# Altium project CNC_Control.PrjPcb
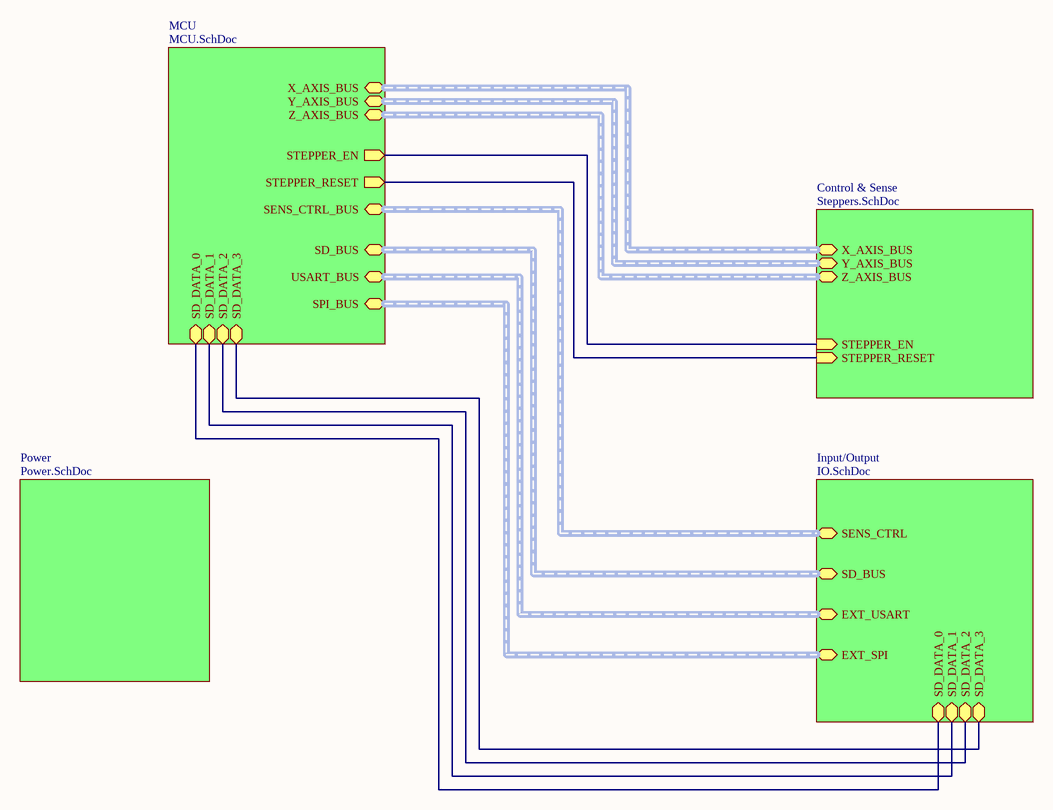
[diagram p0: Master.SchDoc]
5 sheets, 75 parts. Net scope: hierarchical (ports join the sheet entries above them; power ports are global).
Board file: CNC-Control.PcbDoc
Sheets:
  Master.SchDoc
    MCU = MCU.SchDoc
    Control & Sense = Steppers.SchDoc
    Power = Power.SchDoc
    Input/Output = IO.SchDoc

## Sheet Master.SchDoc
size A4

### Sub-sheets
Control & Sense = Steppers.SchDoc: X_AXIS_BUS (harness STEPPER), Y_AXIS_BUS (harness STEPPER), Z_AXIS_BUS (harness STEPPER), STEPPER_EN (in), STEPPER_RESET (in)
Input/Output = IO.SchDoc: SENS_CTRL (harness SENS_CTRL), SD_BUS (harness SD_CARD), EXT_USART (harness USART), EXT_SPI (harness SPI), SD_DATA_0 (bidir), SD_DATA_1 (bidir), SD_DATA_2 (bidir), SD_DATA_3 (bidir)
MCU = MCU.SchDoc: X_AXIS_BUS (harness STEPPER), Y_AXIS_BUS (harness STEPPER), Z_AXIS_BUS (harness STEPPER), STEPPER_EN (out), STEPPER_RESET (out), SENS_CTRL_BUS (harness SENS_CTRL), USART_BUS (harness USART), SD_BUS (harness SD_CARD), SPI_BUS (harness SPI), SD_DATA_0 (bidir), SD_DATA_1 (bidir), SD_DATA_2 (bidir), SD_DATA_3 (bidir)
Power = Power.SchDoc: no entries

### Nets
STEPPER_EN: sheet MCU/STEPPER_EN, sheet Control & Sense/STEPPER_EN
STEPPER_RESET: sheet MCU/STEPPER_RESET, sheet Control & Sense/STEPPER_RESET
NetJ301_1: sheet MCU/SD_DATA_2, sheet Input/Output/SD_DATA_2
NetJ301_2: sheet MCU/SD_DATA_3, sheet Input/Output/SD_DATA_3
NetJ301_7: sheet MCU/SD_DATA_0, sheet Input/Output/SD_DATA_0
NetJ301_8: sheet MCU/SD_DATA_1, sheet Input/Output/SD_DATA_1

### Buses and harness runs
harness sheet Control & Sense/X_AXIS_BUS = sheet MCU/X_AXIS_BUS
harness sheet Control & Sense/Y_AXIS_BUS = sheet MCU/Y_AXIS_BUS
harness sheet Control & Sense/Z_AXIS_BUS = sheet MCU/Z_AXIS_BUS
harness sheet Input/Output/EXT_SPI = sheet MCU/SPI_BUS
harness sheet Input/Output/EXT_USART = sheet MCU/USART_BUS
harness sheet Input/Output/SD_BUS = sheet MCU/SD_BUS
harness sheet Input/Output/SENS_CTRL = sheet MCU/SENS_CTRL_BUS

## Sheet MCU.SchDoc
size A4
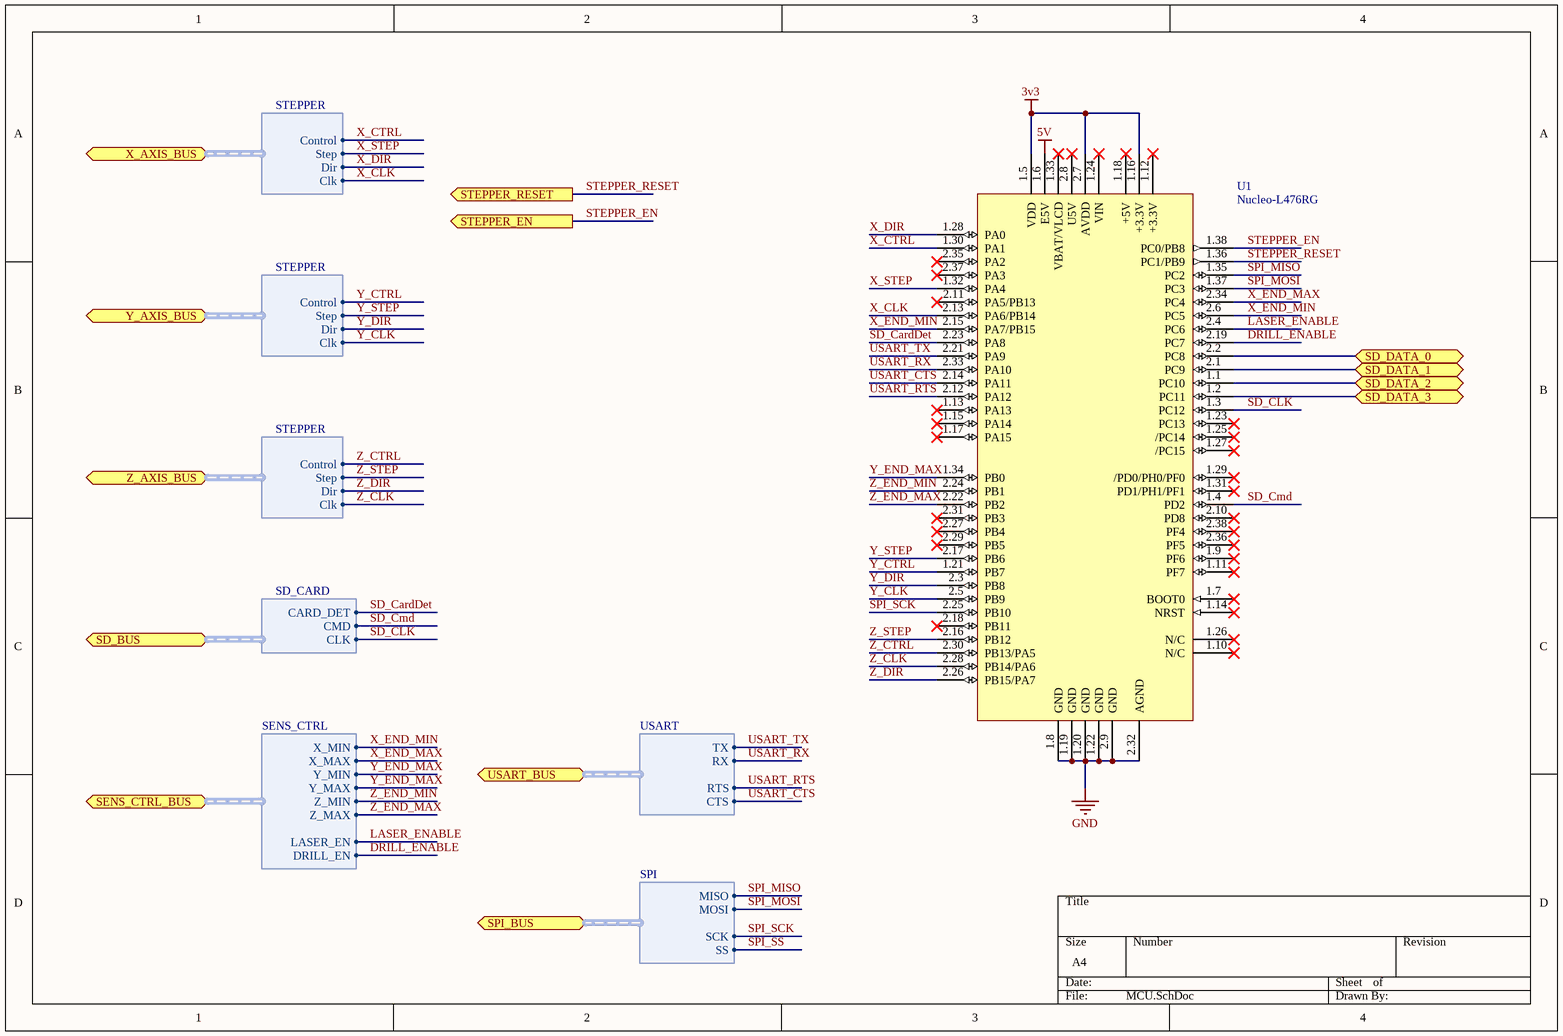
[diagram p1: MCU.SchDoc]

### Parts
U1  Nucleo-L476RG  [NUCLEO--F103RB]

### Ports
SD_BUS (harness SD_CARD), SD_DATA_0 (bidir), SD_DATA_1 (bidir), SD_DATA_2 (bidir), SD_DATA_3 (bidir), SENS_CTRL_BUS (harness SENS_CTRL), SPI_BUS (harness SPI), STEPPER_EN (out), STEPPER_RESET (out), USART_BUS (harness USART), X_AXIS_BUS (harness STEPPER), Y_AXIS_BUS (harness STEPPER), Z_AXIS_BUS (harness STEPPER)

### Harnesses
STEPPER: Clk, Dir, Step, Control
SD_CARD: CARD_DET, CMD, CLK
SENS_CTRL: X_MIN, X_MAX, Y_MIN, Y_MAX, Z_MIN, Z_MAX, LASER_EN, DRILL_EN
USART: TX, RX, RTS, CTS
SPI: MISO, MOSI, SCK, SS

### Nets
3v3: U1.1.5(VDD) U1.1.16(+3.3V) U1.2.7(AVDD)
5V: U1.1.6(E5V)
GND: U1.1.8(GND) U1.1.19(GND) U1.1.20(GND) U1.1.22(GND) U1.2.9(GND) U1.2.32(AGND)
DRILL_ENABLE: U1.2.19(PC7) ; port SENS_CTRL_BUS.DRILL_EN
LASER_ENABLE: U1.2.4(PC6) ; port SENS_CTRL_BUS.LASER_EN
SD_CardDet: U1.2.23(PA8) ; port SD_BUS.CARD_DET
SD_CLK: U1.1.3(PC12) ; port SD_BUS.CLK
SD_Cmd: U1.1.4(PD2) ; port SD_BUS.CMD
SPI_MISO: U1.1.35(PC2) ; port SPI_BUS.MISO
SPI_MOSI: U1.1.37(PC3) ; port SPI_BUS.MOSI
SPI_SCK: U1.2.25(PB10) ; port SPI_BUS.SCK
STEPPER_EN: U1.1.38(PC0/PB8) ; port STEPPER_EN
STEPPER_RESET: U1.1.36(PC1/PB9) ; port STEPPER_RESET
USART_CTS: U1.2.14(PA11) ; port USART_BUS.CTS
USART_RTS: U1.2.12(PA12) ; port USART_BUS.RTS
USART_RX: U1.2.33(PA10) ; port USART_BUS.RX
USART_TX: U1.2.21(PA9) ; port USART_BUS.TX
X_CLK: U1.2.13(PA6/PB14) ; port X_AXIS_BUS.Clk
X_CTRL: U1.1.30(PA1) ; port X_AXIS_BUS.Control  [project net X_AXIS_CTRL]
X_DIR: U1.1.28(PA0) ; port X_AXIS_BUS.Dir  [project net X_AXIS_DIR]
X_END_MAX: U1.2.34(PC4) ; port SENS_CTRL_BUS.X_MAX
X_END_MIN: U1.2.6(PC5) U1.2.15(PA7/PB15) ; port SENS_CTRL_BUS.X_MIN
X_STEP: U1.1.32(PA4) ; port X_AXIS_BUS.Step  [project net X_AXIS_STEP]
Y_CLK: U1.2.5(PB9) ; port Y_AXIS_BUS.Clk
Y_CTRL: U1.1.21(PB7) ; port Y_AXIS_BUS.Control
Y_DIR: U1.2.3(PB8) ; port Y_AXIS_BUS.Dir
Y_END_MAX: U1.1.34(PB0) ; port SENS_CTRL_BUS.Y_MIN, port SENS_CTRL_BUS.Y_MAX
Y_STEP: U1.2.17(PB6) ; port Y_AXIS_BUS.Step
Z_CLK: U1.2.28(PB14/PA6) ; port Z_AXIS_BUS.Clk
Z_CTRL: U1.2.30(PB13/PA5) ; port Z_AXIS_BUS.Control
Z_DIR: U1.2.26(PB15/PA7) ; port Z_AXIS_BUS.Dir
Z_END_MAX: U1.2.22(PB2) ; port SENS_CTRL_BUS.Z_MAX
Z_END_MIN: U1.2.24(PB1) ; port SENS_CTRL_BUS.Z_MIN
Z_STEP: U1.2.16(PB12) ; port Z_AXIS_BUS.Step
NetJ301_1: U1.1.1(PC10) ; port SD_DATA_2
NetJ301_2: U1.1.2(PC11) ; port SD_DATA_3
NetJ301_7: U1.2.2(PC8) ; port SD_DATA_0
NetJ301_8: U1.2.1(PC9) ; port SD_DATA_1

Not connected (* = marked no-connect by the designer): U1 1.7(BOOT0)* 1.9(PF6)* 1.10(N/C)* 1.11(PF7)* 1.12(+3.3V)* 1.13(PA13)* 1.14(NRST)* 1.15(PA14)* 1.17(PA15)* 1.18(+5V)* 1.23(PC13)* 1.24(VIN)* 1.25(/PC14)* 1.26(N/C)* 1.27(/PC15)* 1.29(/PD0/PH0/PF0)* 1.31(PD1/PH1/PF1)* 1.33(VBAT/VLCD)* 2.8(U5V)* 2.10(PD8)* 2.11(PA5/PB13)* 2.18(PB11)* 2.27(PB4)* 2.29(PB5)* 2.31(PB3)* 2.35(PA2)* 2.36(PF5)* 2.37(PA3)* 2.38(PF4)*

### Library data of the parts
U1 = Nucleo-F103RB

## Sheet Steppers.SchDoc
size A4
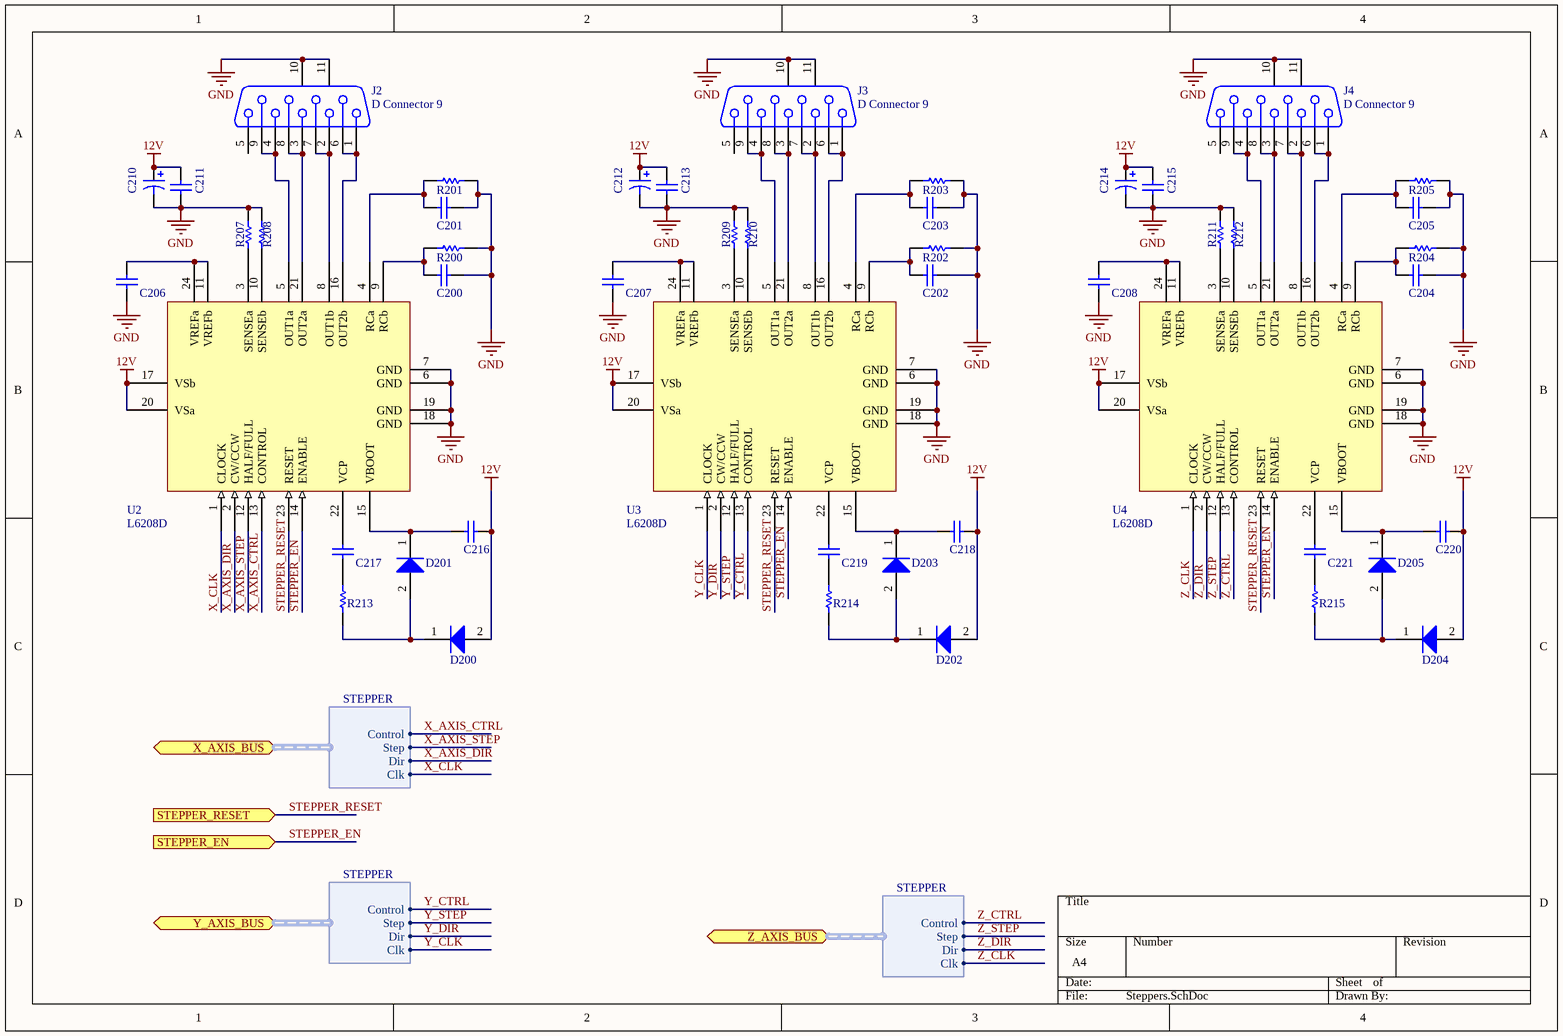
[diagram p2: Steppers.SchDoc]

### Parts
C200  CAP 100nF 10V 1206(3216)  [CAPC1206(3216)190_N]  (value not drawn)
C201  CAP 100nF 10V 1206(3216)  [CAPC1206(3216)190_N]  (value not drawn)
C202  CAP 100nF 10V 1206(3216)  [CAPC1206(3216)190_N]  (value not drawn)
C203  CAP 100nF 10V 1206(3216)  [CAPC1206(3216)190_N]  (value not drawn)
C204  CAP 100nF 10V 1206(3216)  [CAPC1206(3216)190_N]  (value not drawn)
C205  CAP 100nF 10V 1206(3216)  [CAPC1206(3216)190_N]  (value not drawn)
C206  CAP 100nF 10V 1206(3216)  [CAPC1206(3216)190_N]  (value not drawn)
C207  CAP 100nF 10V 1206(3216)  [CAPC1206(3216)190_N]  (value not drawn)
C208  CAP 100nF 10V 1206(3216)  [CAPC1206(3216)190_N]  (value not drawn)
C210  T491B  [B]  (value not drawn)
C211  CAP 100nF 10V 1206(3216)  [CAPC1206(3216)190_N]  (value not drawn)
C212  T491B  [B]  (value not drawn)
C213  CAP 100nF 10V 1206(3216)  [CAPC1206(3216)190_N]  (value not drawn)
C214  T491B  [B]  (value not drawn)
C215  CAP 100nF 10V 1206(3216)  [CAPC1206(3216)190_N]  (value not drawn)
C216  CAP 100nF 10V 1206(3216)  [CAPC1206(3216)190_N]  (value not drawn)
C217  CAP 100nF 10V 1206(3216)  [CAPC1206(3216)190_N]  (value not drawn)
C218  CAP 100nF 10V 1206(3216)  [CAPC1206(3216)190_N]  (value not drawn)
C219  CAP 100nF 10V 1206(3216)  [CAPC1206(3216)190_N]  (value not drawn)
C220  CAP 100nF 10V 1206(3216)  [CAPC1206(3216)190_N]  (value not drawn)
C221  CAP 100nF 10V 1206(3216)  [CAPC1206(3216)190_N]  (value not drawn)
D200  NSR0340HT1G  [ONSC-SOD-323-2-477-02_V]  (value not drawn)
D201  NSR0340HT1G  [ONSC-SOD-323-2-477-02_V]  (value not drawn)
D202  NSR0340HT1G  [ONSC-SOD-323-2-477-02_V]  (value not drawn)
D203  NSR0340HT1G  [ONSC-SOD-323-2-477-02_V]  (value not drawn)
D204  NSR0340HT1G  [ONSC-SOD-323-2-477-02_V]  (value not drawn)
D205  NSR0340HT1G  [ONSC-SOD-323-2-477-02_V]  (value not drawn)
J2  D Connector 9  [DSUB1.385-2H9]
J3  D Connector 9  [DSUB1.385-2H9]
J4  D Connector 9  [DSUB1.385-2H9]
R200  1K 5% 1206(3216)  [RESC1206(3216)_N]  (value not drawn)
R201  1K 5% 1206(3216)  [RESC1206(3216)_N]  (value not drawn)
R202  1K 5% 1206(3216)  [RESC1206(3216)_N]  (value not drawn)
R203  1K 5% 1206(3216)  [RESC1206(3216)_N]  (value not drawn)
R204  1K 5% 1206(3216)  [RESC1206(3216)_N]  (value not drawn)
R205  1K 5% 1206(3216)  [RESC1206(3216)_N]  (value not drawn)
R207  1R 5% 1210(3225)  [RESC1210(3225)_N]  (value not drawn)
R208  1R 5% 1210(3225)  [RESC1210(3225)_N]  (value not drawn)
R209  1R 5% 1210(3225)  [RESC1210(3225)_N]  (value not drawn)
R210  1R 5% 1210(3225)  [RESC1210(3225)_N]  (value not drawn)
R211  1R 5% 1210(3225)  [RESC1210(3225)_N]  (value not drawn)
R212  1R 5% 1210(3225)  [RESC1210(3225)_N]  (value not drawn)
R213  1K 5% 1206(3216)  [RESC1206(3216)_N]  (value not drawn)
R214  1K 5% 1206(3216)  [RESC1206(3216)_N]  (value not drawn)
R215  1K 5% 1206(3216)  [RESC1206(3216)_N]  (value not drawn)
U2  L6208D  [SO24_L]
U3  L6208D  [SO24_L]
U4  L6208D  [SO24_L]

### Ports
STEPPER_EN (in), STEPPER_RESET (in), X_AXIS_BUS (harness STEPPER), Y_AXIS_BUS (harness STEPPER), Z_AXIS_BUS (harness STEPPER)

### Harnesses
STEPPER: Clk, Dir, Step, Control

### Nets
12V: C210.1 C211.2 C212.1 C213.2 C214.1 C215.2 C216.1 C218.1 C220.1 D200.2(A) D202.2(A) D204.2(A) U2.17(VSb) U2.20(VSa) U3.17(VSb) U3.20(VSa) U4.17(VSb) U4.20(VSa)
GND: C200.2 C201.2 C202.2 C203.2 C204.2 C205.2 C206.1 C207.1 C208.1 C210.2 C211.1 C212.2 C213.1 C214.2 C215.1 J2.10(MH1) J2.11(MH2) J3.10(MH1) J3.11(MH2) J4.10(MH1) J4.11(MH2) R200.2 R201.2 R202.2 R203.2 R204.2 R205.2 R207.2 R208.2 R209.2 R210.2 R211.2 R212.2 U2.6(GND) U2.7(GND) U2.18(GND) U2.19(GND) U3.6(GND) U3.7(GND) U3.18(GND) U3.19(GND) U4.6(GND) U4.7(GND) U4.18(GND) U4.19(GND)
STEPPER_EN: U2.14(ENABLE) U3.14(ENABLE) U4.14(ENABLE) ; port STEPPER_EN
STEPPER_RESET: U2.23(RESET) U3.23(RESET) U4.23(RESET) ; port STEPPER_RESET
X_AXIS_CTRL: U2.13(CONTROL) ; port X_AXIS_BUS.Control
X_AXIS_DIR: U2.2(CW/CCW) ; port X_AXIS_BUS.Dir
X_AXIS_STEP: U2.12(HALF/FULL) ; port X_AXIS_BUS.Step
X_CLK: U2.1(CLOCK) ; port X_AXIS_BUS.Clk
Y_CLK: U3.1(CLOCK) ; port Y_AXIS_BUS.Clk
Y_CTRL: U3.13(CONTROL) ; port Y_AXIS_BUS.Control
Y_DIR: U3.2(CW/CCW) ; port Y_AXIS_BUS.Dir
Y_STEP: U3.12(HALF/FULL) ; port Y_AXIS_BUS.Step
Z_CLK: U4.1(CLOCK) ; port Z_AXIS_BUS.Clk
Z_CTRL: U4.13(CONTROL) ; port Z_AXIS_BUS.Control
Z_DIR: U4.2(CW/CCW) ; port Z_AXIS_BUS.Dir
Z_STEP: U4.12(HALF/FULL) ; port Z_AXIS_BUS.Step
NetC200_1: C200.1 R200.1 U2.9(RCb)
NetC201_1: C201.1 R201.1 U2.4(RCa)
NetC202_1: C202.1 R202.1 U3.9(RCb)
NetC203_1: C203.1 R203.1 U3.4(RCa)
NetC204_1: C204.1 R204.1 U4.9(RCb)
NetC205_1: C205.1 R205.1 U4.4(RCa)
NetC206_2: C206.2 U2.11(VREFb) U2.24(VREFa)
NetC207_2: C207.2 U3.11(VREFb) U3.24(VREFa)
NetC208_2: C208.2 U4.11(VREFb) U4.24(VREFa)
NetC216_2: C216.2 D201.1(K) U2.15(VBOOT)
NetC217_1: C217.1 R213.2
NetC217_2: C217.2 U2.22(VCP)
NetC218_2: C218.2 D203.1(K) U3.15(VBOOT)
NetC219_1: C219.1 R214.2
NetC219_2: C219.2 U3.22(VCP)
NetC220_2: C220.2 D205.1(K) U4.15(VBOOT)
NetC221_1: C221.1 R215.2
NetC221_2: C221.2 U4.22(VCP)
NetD200_1: D200.1(K) D201.2(A) R213.1
NetD202_1: D202.1(K) D203.2(A) R214.1
NetD204_1: D204.1(K) D205.2(A) R215.1
NetJ2_1: J2.1 J2.6 U2.16(OUT2b)
NetJ2_2: J2.2 J2.7 U2.8(OUT1b)
NetJ2_3: J2.3 J2.8 U2.21(OUT2a)
NetJ2_4: J2.4 J2.9 U2.5(OUT1a)
NetJ3_1: J3.1 J3.6 U3.16(OUT2b)
NetJ3_2: J3.2 J3.7 U3.8(OUT1b)
NetJ3_3: J3.3 J3.8 U3.21(OUT2a)
NetJ3_4: J3.4 J3.9 U3.5(OUT1a)
NetJ4_1: J4.1 J4.6 U4.16(OUT2b)
NetJ4_2: J4.2 J4.7 U4.8(OUT1b)
NetJ4_3: J4.3 J4.8 U4.21(OUT2a)
NetJ4_4: J4.4 J4.9 U4.5(OUT1a)
NetR207_1: R207.1 U2.3(SENSEa)
NetR208_1: R208.1 U2.10(SENSEb)
NetR209_1: R209.1 U3.3(SENSEa)
NetR210_1: R210.1 U3.10(SENSEb)
NetR211_1: R211.1 U4.3(SENSEa)
NetR212_1: R212.1 U4.10(SENSEb)

Not connected (* = marked no-connect by the designer): J2 5; J3 5; J4 5

### Library data of the parts
C200-C208 C211 C213 C215-C221 = CMP-1037-04171-1: CAP 100nF 10V ±5% 1206 (3216 Metric) Thickness 1.9mm SMD; Tolerance: Â±5%; Case-Metric: 3216; Case-EIA: 1206; Value: 100nF; Rated Voltage: 10 V; Technology: SMT; Max Thickness: 1.9 mm
C210 C212 C214 = T491B: Solid Tantalum Chip Capacitor, Standard T491 Series - Industrial Grade; Value: 100pF; Published: 17-Jul-2002; LatestRevisionDate: 19-Mar-2004; LatestRevisionNote: Silkscreen dimensions re-sized.; DatasheetDocument: Mar-2001; PackageDocument: Mar-2001; PackageReference: B; Publisher: Altium Limited; Code_JEITA: 3528-21; ComponentLink1Description: Manufacturer Link; ComponentLink1URL: http://www.kemet.com/; ComponentLink2Description: Datasheet; ComponentLink2URL: http://www.kemet.com/kemet/web/homepage/kechome.nsf/vapubfilesname/F3102TA.pdf/$file/F3102TA.pdf
D200-D205 = CMP-1055-00472-1: Schottky Barrier Diode, 2-Pin SOD-323, Pb-Free, Tape and Reel; Manufacturer: On Semiconductor; IFSM Max (A): 1; Configuration: Single; PackageDescription: 2-Pin SOD, Body 1.7 x 1.25 mm; ComponentLink2Description: Datasheet; PartNumber: NSR0340HT1G; ComponentLink3URL: http://www.onsemi.com/pub_link/Collateral/477-02.PDF.1; Packing: Tape and Reel; PackageVersion: Rev. H, 03/2007; ComponentLink1URL: http://www.onsemi.com/; ComponentLink2URL: http://www.onsemi.cn/pub_link/Collateral/NSR0340H-D.PDF; ComponentLink3Description: Package Specification; ComponentLink1Description: Manufacturer URL; Mounting Technology: Surface Mount; RoHS: TRUE; PackageReference: SOD-323-2-477-02; DatasheetVersion: Rev. 1
J2-J4 = D Connector 9: Receptacle Assembly, 9 Position, Right Angle; PackageDocument: O; Positions: 9; Published: 15-Jun-2001; LatestRevisionDate: 17-Jul-2002; LatestRevisionNote: Re-released for DXP Platform.; DatasheetDocument: 1-Sep-1999; PackageReference: 788750; Publisher: Altium Limited; Orientation: Right Angle; Gender: Receptacle
R200-R205 R213-R215 = CMP-1014-00074-1: 1K 0.25W 5% 1206 (3216 Metric)  SMD; Value: 1000.00 Ohm; Case-Metric: 3216; Case-EIA: 1206; Tolerance: 5 %; Power: 0.25 W; Technology: SMT
R207-R212 = CMP-1015-00002-1: 1R 0.5W 5% 1210 (3225 Metric)  SMD; Case-EIA: 1210; Value: 1.00 Ohm; Case-Metric: 3225; Power: 0.5 W; Technology: SMT; Tolerance: 5 %
U2-U4 = L6208D: Stepper controler

## Sheet Power.SchDoc
size A4
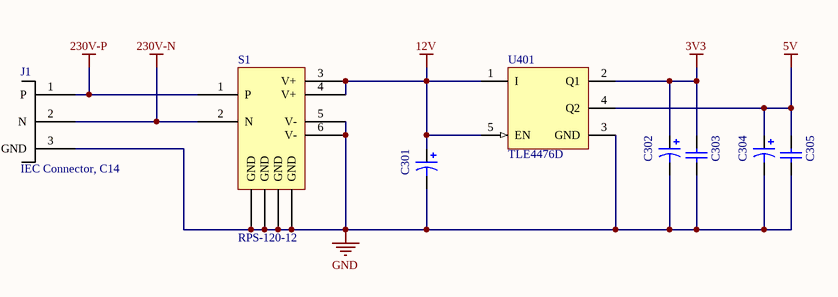
[diagram p3: Power.SchDoc]

### Parts
C301  T491B  [B]  (value not drawn)
C302  T491B  [B]  (value not drawn)
C303  CAP 100nF 10V 1206(3216)  [CAPC1206(3216)190_N]  (value not drawn)
C304  T491B  [B]  (value not drawn)
C305  CAP 100nF 10V 1206(3216)  [CAPC1206(3216)190_N]  (value not drawn)
J1  IEC Connector, C14  [PX0580]
S1  RPS-120-12  [RPS-120-12]
U401  TLE4476D  [INF-PG-TO252-5-11_M]

### Nets
3v3: C302.1 C303.2 U401.2(Q1)
5V: C304.1 C305.2 U401.4(Q2)
12V: C301.1 S1.3(V+) S1.4(V+) U401.1(I) U401.5(EN)
230V-N: J1.2(N) S1.2(N)
230V-P: J1.1(P) S1.1(P)
GND: C301.2 C302.2 C303.1 C304.2 C305.1 J1.3(GND) S1.5(V-) S1.6(V-) S1.H1(GND) S1.H2(GND) S1.H3(GND) S1.H4(GND) U401.3(GND)

### Library data of the parts
C301 C302 C304 = T491B: as C210 on sheet Steppers; Published: 17-Jul-2002; LatestRevisionDate: 19-Mar-2004; LatestRevisionNote: Silkscreen dimensions re-sized.; DatasheetDocument: Mar-2001; PackageDocument: Mar-2001; PackageReference: B; Publisher: Altium Limited; Code_JEITA: 3528-21; ComponentLink1Description: Manufacturer Link; ComponentLink1URL: http://www.kemet.com/; ComponentLink2Description: Datasheet; ComponentLink2URL: http://www.kemet.com/kemet/web/homepage/kechome.nsf/vapubfilesname/F3102TA.pdf/$file/F3102TA.pdf
C303 C305 = CMP-1037-04171-1: as C200 on sheet Steppers; Value: 100nF; Rated Voltage: 10 V; Technology: SMT; Max Thickness: 1.9 mm
J1 = PX0580/PC/12132: IEC C14, Right Angle Male, Mounting Holes; Ref: PX0580/PC/12132
S1 = RPS-120-12: Power supply, 120 W, 12V/10A, unenclosed; Ref: RPS-120-12
U401 = CMP-1109-00149-1: Dual Low Drop Voltage Regulator, 4.5 to 42 V / 5.7 to 42 V Supply, 3.3 V 5 V Output, -40 to 150 degC, PG-TO252-5-11, Reel, Green; Manufacturer: Infineon; Typical Quiescent Current: 300 uA; Regulator Type: multiple output; Max. Output Current: 350 mA 430 mA; Operating Range: 4.5 to 42 V 5.7 to 42 V; Dropout Voltage: 1200 mV 300 mV; Accuracy: 4 % 4 %; Green: TRUE; Output Voltage: 3.3V 5V; ComponentLink1Description: Manufacturer URL; ComponentLink3URL: http://www.infineon.com/dgdl/TLE7276-Data+Sheet-+v1_11.pdf?folderId=db3a304412b407950112b408e8c90004&fileId=db3a304412b407950112b436c53f66c8&sId=db3a30433db6f09f013dc0e43c0428c1; ComponentLink2URL: http://www.infineon.com/dgdl/TLE4476_DS_25%5B1%5D.pdf?folderId=db3a304318f3fe290118f5a433570040&fileId=db3a30431c48a312011c55e0456c0243&location=en.Products.Automotive_ICs.Linear_Voltage_Regulators_for_Automotive-Applications.Linear_Voltage_Regulators_-_Se; ComponentLink1URL: http://www.infineon.com/; PackageReference: PG-TO252-5-11; PackageDescription: 5-Pin Plastic (Green) Transistor Single Outline Package, 6.5 x 6.12 mm Body, 1.14 mm Pitch; ComponentLink2Description: Datasheet; PackageVersion: Nov-10; PartNumber: TLE4476D; Packing: Reel; Mounting Technology: Surface Mount; DatasheetVersion: Rev. 2.5; Halogen-free: TRUE; ComponentLink3Description: Package Specification

## Sheet IO.SchDoc
size A4
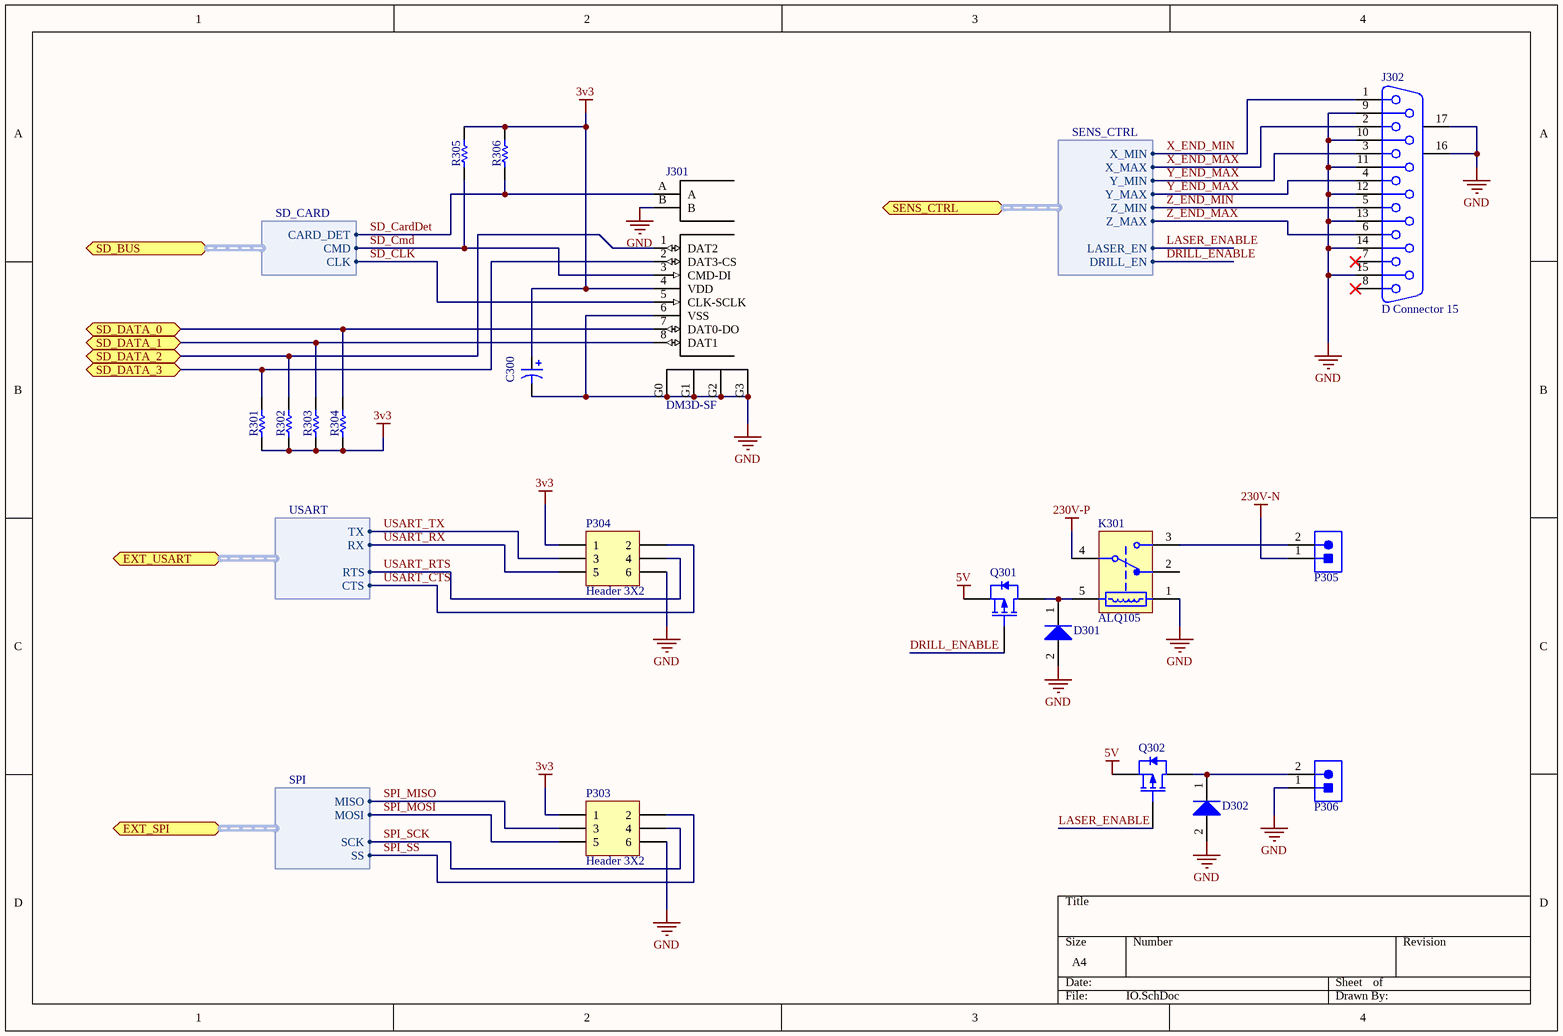
[diagram p4: IO.SchDoc]

### Parts
C300  T491B  [B]  (value not drawn)
D301  NSR0340HT1G  [ONSC-SOD-323-2-477-02_V]  (value not drawn)
D302  NSR0340HT1G  [ONSC-SOD-323-2-477-02_V]  (value not drawn)
J301  DM3D-SF  [DM3D-SF]
J302  D Connector 15  [DSUB1.385-2H15]
K301  ALQ105  [PNSC-LQ-5-2000x1000x1600_V]
P303  Header 3X2  [HDR2X3]
P304  Header 3X2  [HDR2X3]
P305  SCREW-5.0/5.08 2WAYS  [SCREW-5.0-2WAYS_V]  (value not drawn)
P306  SCREW-5.0/5.08 2WAYS  [SCREW-5.0-2WAYS_V]  (value not drawn)
Q301  BSS84  [SOT23_N]  (value not drawn)
Q302  BSS84  [SOT23_N]  (value not drawn)
R301  1K 5% 1206(3216)  [RESC1206(3216)_N]  (value not drawn)
R302  1K 5% 1206(3216)  [RESC1206(3216)_N]  (value not drawn)
R303  1K 5% 1206(3216)  [RESC1206(3216)_N]  (value not drawn)
R304  1K 5% 1206(3216)  [RESC1206(3216)_N]  (value not drawn)
R305  1K 5% 1206(3216)  [RESC1206(3216)_N]  (value not drawn)
R306  1K 5% 1206(3216)  [RESC1206(3216)_N]  (value not drawn)

### Ports
EXT_SPI (harness SPI), EXT_USART (harness USART), SD_BUS (harness SD_CARD), SD_DATA_0 (bidir), SD_DATA_1 (bidir), SD_DATA_2 (bidir), SD_DATA_3 (bidir), SENS_CTRL (harness SENS_CTRL)

### Harnesses
SENS_CTRL: X_MIN, X_MAX, Y_MIN, Y_MAX, Z_MIN, Z_MAX, LASER_EN, DRILL_EN
USART: TX, RX, RTS, CTS
SPI: MISO, MOSI, SCK, SS
SD_CARD: CARD_DET, CMD, CLK

### Nets
3v3: C300.1 J301.4(VDD) P303.1 P304.1 R301.1 R302.1 R303.1 R304.1 R305.2 R306.2
5V: Q301.2(S) Q302.2(S)
230V-N: P305.1
230V-P: K301.4(COM)
GND: C300.2 D301.2(A) D302.2(A) J301.6(VSS) J301.B J301.G0 J301.G1 J301.G2 J301.G3 J302.9 J302.10 J302.11 J302.12 J302.13 J302.14 J302.15 J302.16(MH1) J302.17(MH2) K301.1 P303.6 P304.6 P306.1
DRILL_ENABLE: Q301.1(G) ; port SENS_CTRL.DRILL_EN
LASER_ENABLE: Q302.1(G) ; port SENS_CTRL.LASER_EN
SD_CardDet: J301.A R306.1 ; port SD_BUS.CARD_DET
SD_CLK: J301.5(CLK-SCLK) ; port SD_BUS.CLK
SD_Cmd: J301.3(CMD-DI) R305.1 ; port SD_BUS.CMD
SPI_MISO: P303.3 ; port EXT_SPI.MISO
SPI_MOSI: P303.5 ; port EXT_SPI.MOSI
SPI_SCK: P303.4 ; port EXT_SPI.SCK
SPI_SS: P303.2 ; port EXT_SPI.SS
USART_CTS: P304.2 ; port EXT_USART.CTS
USART_RTS: P304.4 ; port EXT_USART.RTS
USART_RX: P304.5 ; port EXT_USART.RX
USART_TX: P304.3 ; port EXT_USART.TX
X_END_MAX: J302.2 ; port SENS_CTRL.X_MAX
X_END_MIN: J302.1 ; port SENS_CTRL.X_MIN
Y_END_MAX: J302.3 J302.4 ; port SENS_CTRL.Y_MIN, port SENS_CTRL.Y_MAX
Z_END_MAX: J302.6 ; port SENS_CTRL.Z_MAX
Z_END_MIN: J302.5 ; port SENS_CTRL.Z_MIN
NetD301_1: D301.1(K) K301.5 Q301.3(D)
NetD302_1: D302.1(K) P306.2 Q302.3(D)
NetJ301_1: J301.1(DAT2) R302.2 ; port SD_DATA_2
NetJ301_2: J301.2(DAT3-CS) R301.2 ; port SD_DATA_3
NetJ301_7: J301.7(DAT0-DO) R304.2 ; port SD_DATA_0
NetJ301_8: J301.8(DAT1) R303.2 ; port SD_DATA_1
NetK301_3: K301.3(NO) P305.2

Not connected (* = marked no-connect by the designer): J302 7* 8*; K301 2(NC)

### Library data of the parts
C300 = T491B: as C210 on sheet Steppers; Published: 17-Jul-2002; LatestRevisionDate: 19-Mar-2004; LatestRevisionNote: Silkscreen dimensions re-sized.; DatasheetDocument: Mar-2001; PackageDocument: Mar-2001; PackageReference: B; Publisher: Altium Limited; Code_JEITA: 3528-21; ComponentLink1Description: Manufacturer Link; ComponentLink1URL: http://www.kemet.com/; ComponentLink2Description: Datasheet; ComponentLink2URL: http://www.kemet.com/kemet/web/homepage/kechome.nsf/vapubfilesname/F3102TA.pdf/$file/F3102TA.pdf
D301 D302 = CMP-1055-00472-1: as D200 on sheet Steppers; PackageDescription: 2-Pin SOD, Body 1.7 x 1.25 mm; ComponentLink2Description: Datasheet; PartNumber: NSR0340HT1G; ComponentLink3URL: http://www.onsemi.com/pub_link/Collateral/477-02.PDF.1; Packing: Tape and Reel; PackageVersion: Rev. H, 03/2007; ComponentLink1URL: http://www.onsemi.com/; ComponentLink2URL: http://www.onsemi.cn/pub_link/Collateral/NSR0340H-D.PDF; ComponentLink3Description: Package Specification; ComponentLink1Description: Manufacturer URL; Mounting Technology: Surface Mount; RoHS: TRUE; PackageReference: SOD-323-2-477-02; DatasheetVersion: Rev. 1
J302 = D Connector 15: Receptacle Assembly, 15 Position, Right Angle; PackageDocument: O; Positions: 15; Published: 15-Jun-2001; LatestRevisionDate: 17-Jul-2002; LatestRevisionNote: Re-released for DXP Platform.; DatasheetDocument: 1-Sep-99; PackageReference: 788757; Publisher: Altium Limited; Orientation: Right Angle; Gender: Receptacle
K301 = CMP-1503-00191-1: LQ Relays, 5 V Coil Voltage, 400 mW Nominal Operating Power, -40 to 85 degC, 5-Pin LQ, Carton, Case, RoHS; Manufacturer: Panasonic; Coil Voltage: 5 V; Max Switching Voltage: 250 V AC; Mechanical Life(Min.operation): 1x10^7; Electrical Life: 5x10^4; Pb-Free: True; Nominal Operating Power: 400 mW; Max Switching Current: 10 A (N.O.), 3 A (N.C.); RoHS: True; PackageReference: LQ-5-2000x1000x1600; Packing: Carton, Case; PackageDescription: 5-Pin Through Hole Terminal Package, Body 20 x 10 mm; ComponentLink1Description: Manufacturer URL; ComponentLink3Description: Package Specification; DatasheetVersion: 201410-T; ComponentLink1URL: http://www3.panasonic.biz/ac/ae/index.jsp; ComponentLink3URL: http://www3.panasonic.biz/ac/e_download/control/relay/power/catalog/mech_eng_lq.pdf?f_cd=401220; PartNumber: ALQ105; Mounting Technology: Through Hole; ComponentLink2Description: Datasheet; Series: LQ Relays; ComponentLink2URL: http://www3.panasonic.biz/ac/e_download/control/relay/power/catalog/mech_eng_lq.pdf?f_cd=401220; PackageVersion: ASCTB92E, 10/2014
P303 P304 = Header 3X2: Header, 3-Pin, Dual row; LatestRevisionDate: 17-Jul-2002; LatestRevisionNote: Re-released for DXP Platform.; Publisher: Altium Limited
P305 P306 = CMP-0617-00009-1: Socket, Screw Terminal Block, 2 Way, 5.0 mm Pitch, 90 Degree Angle, Through-Hole; Manufacturer: No Vendor; Insulation Resistance: 5000 MOhm / 1000 V; Contact Resistance: 20 mOhm; Rated Current: 25 A; Poles: 2; Rated Voltage: 300 V; PartNumber: SCREW-5.0/5.08 2WAYS; ComponentLink1Description: Datasheet; ComponentLink1URL: 5mm screw terminal in SVN; Mounting Technology: Through Hole; PackageDescription: Socket, Screw Terminal Block, 2 Way, Pitch 5 mm, 90 Degree Angle, Through-Hole; Temperature Range: -40 to 105 degC
Q301 Q302 = BSS84: P-channel Enhancement Mode Vertical D-MOSFET; Published: 17-Sep-2003; LatestRevisionDate: 12-Dec-2006; LatestRevisionNote: IPC-7351 Footprint Added.; DatasheetVersion: 18-Jun-1997; PackageVersion: May-1999; PackageReference: SOT23; Publisher: Altium Limited; PackageDescription: 3-Pin SOT-23 Package 0.95 mm Pitch, 2.3 mm Lead Span; ComponentLink1Description: Manufacturer Link; ComponentLink1URL: http://www.semiconductors.philips.com/; ComponentLink2Description: Datasheet; ComponentLink2URL: http://www.semiconductors.philips.com/acrobat/datasheets/BSS84_3.pdf
R301-R306 = CMP-1014-00074-1: as R200 on sheet Steppers; Tolerance: 5 %; Power: 0.25 W; Technology: SMT

## Nets that join several sheets
3v3: MCU (U1.1.5 U1.1.16 U1.2.7), Power (C302.1 C303.2 U401.2), IO (10 pins)
5V: MCU (U1.1.6), Power (C304.1 C305.2 U401.4), IO (Q301.2 Q302.2)
12V: Steppers (18 pins), Power (5 pins)
230V-N: Power (J1.2 S1.2), IO (P305.1)
230V-P: Power (J1.1 S1.1), IO (K301.4)
GND: MCU (6 pins), Steppers (45 pins), Power (13 pins), IO (22 pins)
DRILL_ENABLE: MCU (U1.2.19), IO (Q301.1)
LASER_ENABLE: MCU (U1.2.4), IO (Q302.1)
NetJ301_1: MCU (U1.1.1), IO (J301.1 R302.2)
NetJ301_2: MCU (U1.1.2), IO (J301.2 R301.2)
NetJ301_7: MCU (U1.2.2), IO (J301.7 R304.2)
NetJ301_8: MCU (U1.2.1), IO (J301.8 R303.2)
SD_CardDet: MCU (U1.2.23), IO (J301.A R306.1)
SD_CLK: MCU (U1.1.3), IO (J301.5)
SD_Cmd: MCU (U1.1.4), IO (J301.3 R305.1)
SPI_MISO: MCU (U1.1.35), IO (P303.3)
SPI_MOSI: MCU (U1.1.37), IO (P303.5)
SPI_SCK: MCU (U1.2.25), IO (P303.4)
STEPPER_EN: MCU (U1.1.38), Steppers (U2.14 U3.14 U4.14)
STEPPER_RESET: MCU (U1.1.36), Steppers (U2.23 U3.23 U4.23)
USART_CTS: MCU (U1.2.14), IO (P304.2)
USART_RTS: MCU (U1.2.12), IO (P304.4)
USART_RX: MCU (U1.2.33), IO (P304.5)
USART_TX: MCU (U1.2.21), IO (P304.3)
X_AXIS_CTRL: MCU (U1.1.30), Steppers (U2.13)
X_AXIS_DIR: MCU (U1.1.28), Steppers (U2.2)
X_AXIS_STEP: MCU (U1.1.32), Steppers (U2.12)
X_CLK: MCU (U1.2.13), Steppers (U2.1)
X_END_MAX: MCU (U1.2.34), IO (J302.2)
X_END_MIN: MCU (U1.2.6 U1.2.15), IO (J302.1)
Y_CLK: MCU (U1.2.5), Steppers (U3.1)
Y_CTRL: MCU (U1.1.21), Steppers (U3.13)
Y_DIR: MCU (U1.2.3), Steppers (U3.2)
Y_END_MAX: MCU (U1.1.34), IO (J302.3 J302.4)
Y_STEP: MCU (U1.2.17), Steppers (U3.12)
Z_CLK: MCU (U1.2.28), Steppers (U4.1)
Z_CTRL: MCU (U1.2.30), Steppers (U4.13)
Z_DIR: MCU (U1.2.26), Steppers (U4.2)
Z_END_MAX: MCU (U1.2.22), IO (J302.6)
Z_END_MIN: MCU (U1.2.24), IO (J302.5)
Z_STEP: MCU (U1.2.16), Steppers (U4.12)